# EAGLE design usb-bridge (EAGLE 9.6.2)

## Sheet 1 of 2
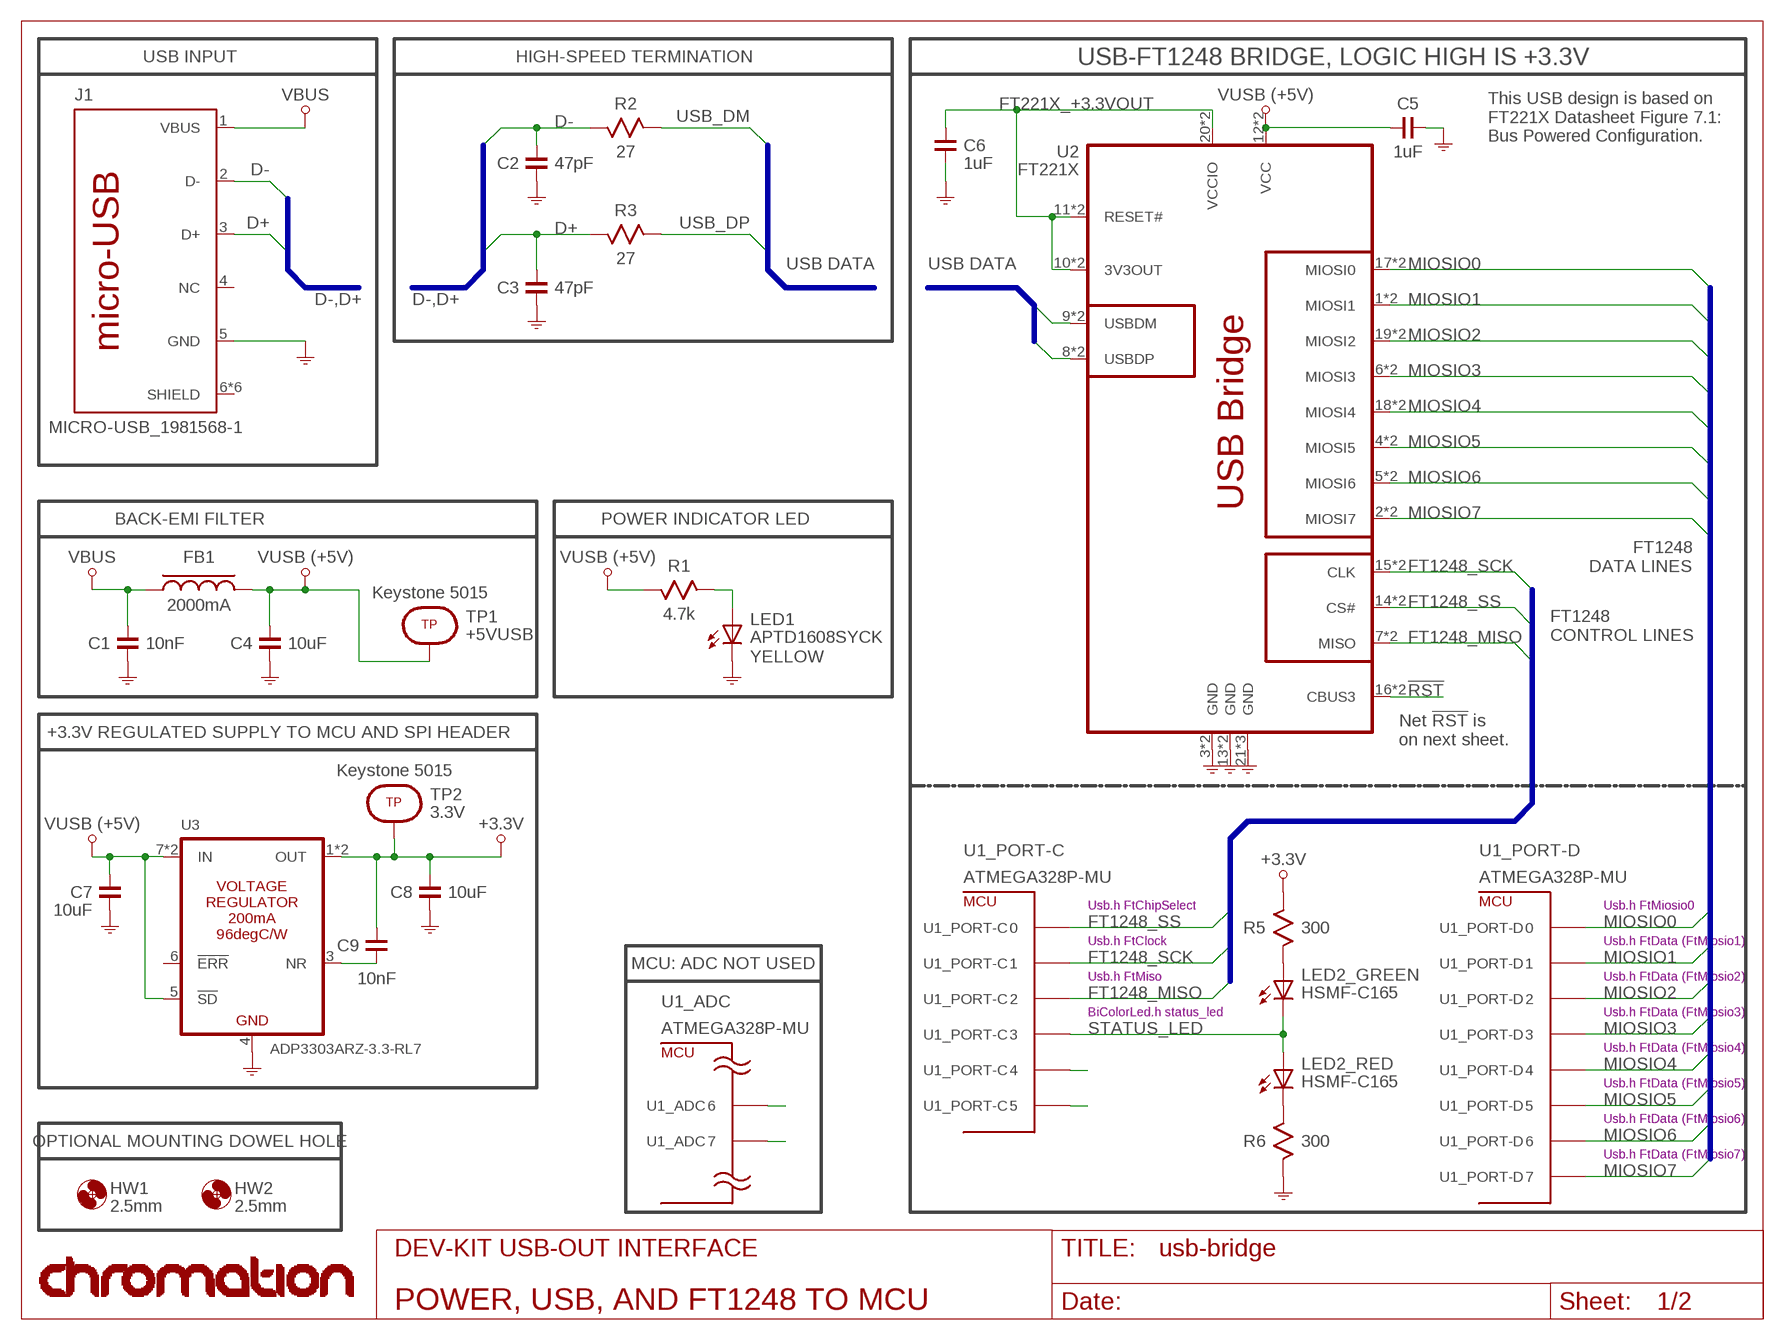
[diagram p0: schematic, sheet 1]

### Parts
C1  10nF  C_0603  [0603]
C2  47pF  C_0603  [0603]
C3  47pF  C_0603  [0603]
C4  10uF  C_0603  [0603]
C5  1uF  C_0603  [0603]
C6  1uF  C_0603  [0603]
C7  10uF  C_0603  [0603]
C8  10uF  C_0603  [0603]
C9  10nF  C_0603  [0603]
FB1  2000mA  FB_0603-LAIRD  [FB-LAIRD-0603]
HW1  2.5mm  DOWEL-PIN_2.5MM-DOWEL  [MCMASTER-93600A265]
HW2  2.5mm  DOWEL-PIN_2.5MM-DOWEL  [MCMASTER-93600A265]
J1  MICRO-USB_1981568-1  [TE_1981568-1]
LED1  APTD1608SYCK  APTD1608SYCK_LED-0603  [LED-0603-KINGBRIGHT]
LED2  HSMF-C165  BICOLOR-LED_HSMF-C16X  [HSMF-C16X]
R1  4.7k  R_0603  [0603]
R2  27  R_0603  [0603]
R3  27  R_0603  [0603]
R5  300  R_0603  [0603]
R6  300  R_0603  [0603]
TP1  Keystone 5015  TEST-POINT_SMT-5015  [SMT-TEST-POINT-5015]
TP2  Keystone 5015  TEST-POINT_SMT-5015  [SMT-TEST-POINT-5015]
U1  ATMEGA328P-MU  [QFN-32_ATMEL]
U2  FT221X  FT221XQ  [QFN-20]
U3  ADP3303ARZ-3.3-RL7  ADP3303_ARZ-3.3  [SOIC-8_AD]

### Nets
!RST!: U2.16(CBUS3) U2._16(CBUS3) ; also sheet 2
+3.3V: C8.1 C9.1 R5.1 TP2.1 U3.1(OUT) U3.2(OUT) ; also sheet 2
+5VUSB: C4.1 C5.1 C7.1 FB1.2 R1.1 TP1.1 U2.12(VCC) U2._12(VCC) U3.5(!SD!) U3.7(IN) U3.8(IN)
D+: C3.1 J1.3(D+) R3.1
D-: C2.1 J1.2(D-) R2.1
FT221X_+3.3VOUT: C6.1 U2.10(3V3OUT) U2.11(RESET#) U2.20(VCCIO) U2._10(3V3OUT) U2._11(RESET#) U2._20(VCCIO)
FT1248_MISO: U1.25 U1.25F U2.7(MISO) U2._7(MISO)
FT1248_SCK: U1.24 U1.24F U2.15(CLK) U2._15(CLK)
FT1248_SS: U1.23 U1.23F U2.14(CS#) U2._14(CS#)
GND: C1.2 C2.2 C3.2 C4.2 C5.2 C6.2 C7.2 C8.2 J1.5(GND) LED1.2(C) R6.2 U2.3(GND) U2.13(GND) U2.21(GND) U2.21A(GND) U2.21B(GND) U2._3(GND) U2._13(GND) U3.4(GND) ; also sheet 2
MIOSIO0: U1.30 U1.30F U2.17(MIOSI0) U2._17(MIOSI0)
MIOSIO1: U1.31 U1.31F U2.1(MIOSI1) U2._1(MIOSI1)
MIOSIO2: U1.32 U1.32F U2.19(MIOSI2) U2._19(MIOSI2)
MIOSIO3: U1.1 U1.1F U2.6(MIOSI3) U2._6(MIOSI3)
MIOSIO4: U1.2 U1.2F U2.18(MIOSI4) U2._18(MIOSI4)
MIOSIO5: U1.9 U1.9F U2.4(MIOSI5) U2._4(MIOSI5)
MIOSIO6: U1.10 U1.10F U2.5(MIOSI6) U2._5(MIOSI6)
MIOSIO7: U1.11 U1.11F U2.2(MIOSI7) U2._2(MIOSI7)
N$1: LED2.4(_RED:C) R6.1
N$2: LED2.1(_GREEN:A) R5.2
N$10: LED1.1(A) R1.2
NOISE_REDUCTION: C9.2 U3.3(NR)
NOT-USED-19: U1.19 U1.19F
NOT-USED-22: U1.22 U1.22F
NOT-USED-27: U1.27 U1.27F
NOT-USED-28: U1.28 U1.28F
STATUS_LED: LED2.2(_RED:A) LED2.3(_GREEN:C) U1.26 U1.26F
USB_DM: R2.2 U2.9(USBDM) U2._9(USBDM)
USB_DP: R3.2 U2.8(USBDP) U2._8(USBDP)
VBUS: C1.1 FB1.1 J1.1(VBUS)
Unconnected: J1.4(NC) J1.6(SHIELD) J1.7(SHIELD) J1.8(SHIELD) J1.9(SHIELD) J1.10(SHIELD) J1.11(SHIELD) U3.6(!ERR!)

### Buses
D-,D+
USB_DM,USB_DP
MIOSIO[0..7]
FT1248_SS,FT1248_SCK,FT1248_MISO

### Notes on the sheet
- USB INPUT | HIGH-SPEED TERMINATION | USB-FT1248 BRIDGE, LOGIC HIGH IS +3.3V
- This USB design is based on
  FT221X Datasheet Figure 7.1:
  Bus Powered Configuration.
- USB DATA | USB DATA
- BACK-EMI FILTER | POWER INDICATOR LED
- FT1248
  DATA LINES
- FT1248
  CONTROL LINES
- YELLOW
- Net !RST! is
  on next sheet.
- +3.3V REGULATED SUPPLY TO MCU AND SPI HEADER
- Usb.h FtChipSelect | Usb.h FtMiosio0
- Usb.h FtClock | Usb.h FtData (FtMiosio1)
- MCU: ADC NOT USED
- Usb.h FtMiso | Usb.h FtData (FtMiosio2)
- BiColorLed.h status_led | Usb.h FtData (FtMiosio3)
- Usb.h FtData (FtMiosio4)
- Usb.h FtData (FtMiosio5)
- Usb.h FtData (FtMiosio6)
- OPTIONAL MOUNTING DOWEL HOLE
- Usb.h FtData (FtMiosio7)
- DEV-KIT USB-OUT INTERFACE
- POWER, USB, AND FT1248 TO MCU

## Sheet 2 of 2
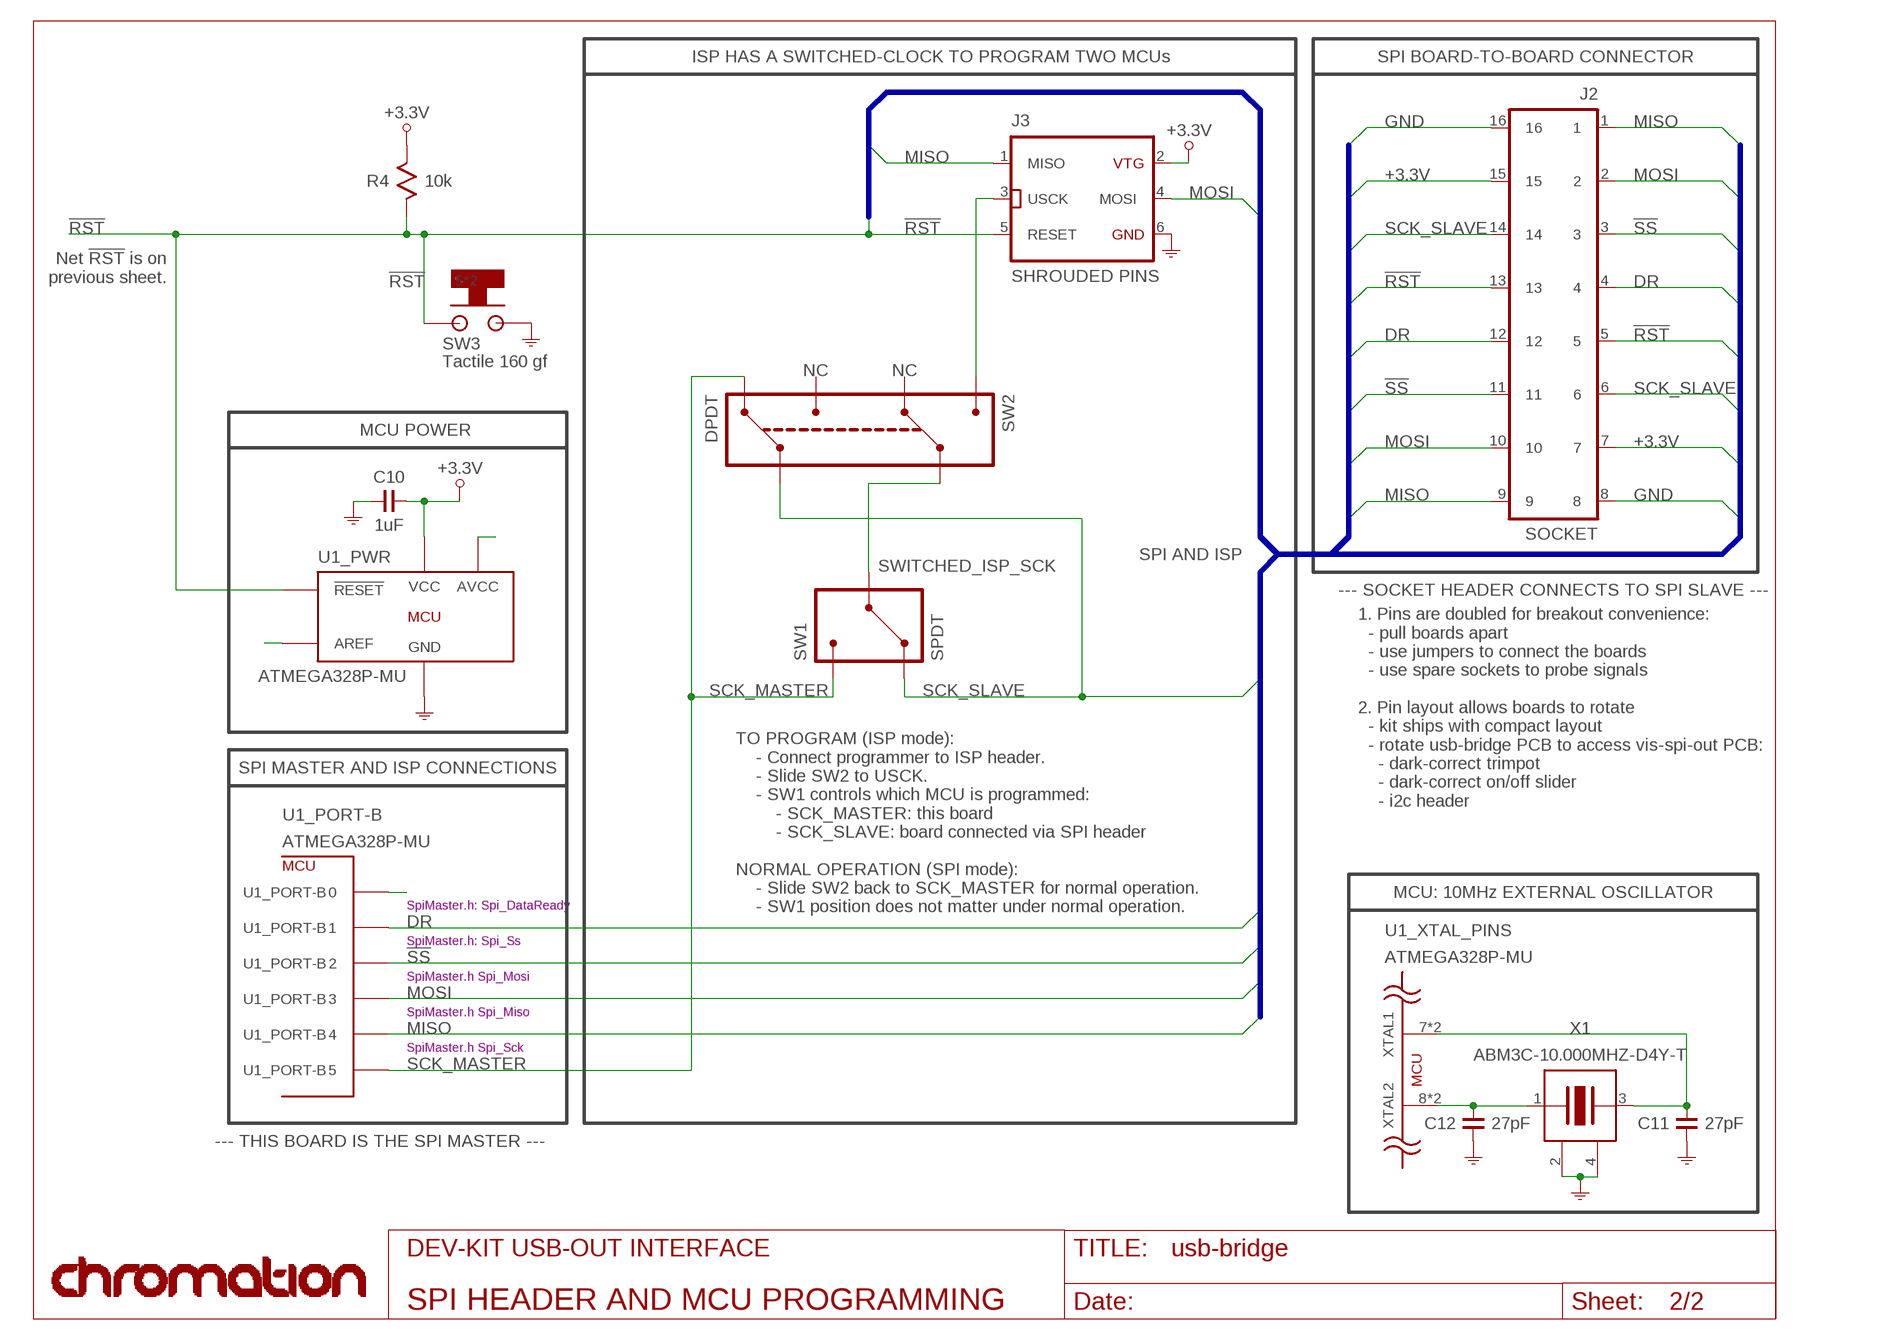
[diagram p1: schematic, sheet 2]

### Parts
C10  1uF  C_0603  [0603]
C11  27pF  C_0603  [0603]
C12  27pF  C_0603  [0603]
J2  SOCKET  HEADER-SOCKET-16_SSM-108-F-DV  [SSM-108-L-DV]
J3  SHROUDED PINS  AVRISP_N2506-6V0C-RB-WD  [N2506-6V0C]
R4  10k  R_0603  [0603]
SW1  SPDT  SW_SPDT_JS102011JCQN  [JS102011JCQN]
SW2  DPDT  SW_DPDT_JS202011JCQN  [JS202011JCQN]
SW3  Tactile 160 gf  PUSH-BUTTON_MSLPT5252BL3MTR  [MSLPT5252BL3MTR]
X1  ABM3C-10.000MHZ-D4Y-T  CRYSTAL_ABM3C-10.000MHZ-D4Y-T  [CRYSTAL]

### Nets
!RST!: J2.5 J2.13 J3.5(RESET) R4.2 SW3.3(3,4) SW3.4(3,4) U1.29(_PWR:!RESET!) U1.29F(_PWR:!RESET!) ; also sheet 1
!SS!: J2.3 J2.11 U1.14 U1.14F
+3.3V: C10.2 J2.7 J2.15 J3.2(VTTL) R4.1 U1.4(_PWR:VCC) U1.4F(_PWR:VCC) U1.6(_PWR:VCC) U1.6F(_PWR:VCC) ; also sheet 1
DR: J2.4 J2.12 U1.13 U1.13F
GND: C10.1 C11.2 C12.2 J2.8 J2.16 J3.6(GND) SW3.1(1,2) SW3.2(1,2) U1.3(_PWR:GND) U1.3F(_PWR:GND) U1.5(_PWR:GND) U1.5F(_PWR:GND) U1.21(_PWR:GND) U1.21F(_PWR:GND) U1.THERMAL(_PWR:GND) X1.2(GND) X1.4(GND) ; also sheet 1
ISP_SCK: J3.3(USCK) SW2.1
MISO: J2.1 J2.9 J3.1(MISO) U1.16 U1.16F
MOSI: J2.2 J2.10 J3.4(MOSI) U1.15 U1.15F
N$3: C11.1 U1.7(_XTAL_PINS:XTAL1) U1.7F(_XTAL_PINS:XTAL1) X1.3
N$4: C12.1 U1.8(_XTAL_PINS:XTAL2) U1.8F(_XTAL_PINS:XTAL2) X1.1
NOT-USED-12: U1.12 U1.12F
NOT-USED-18: U1.18(_PWR:AVCC) U1.18F(_PWR:AVCC)
NOT-USED-20: U1.20(_PWR:AREF) U1.20F(_PWR:AREF)
SCK_MASTER: SW1.1 SW2.6 U1.17 U1.17F
SCK_SLAVE: J2.6 J2.14 SW1.3 SW2.5
SWITCHED_ISP_SCK: SW1.2 SW2.2
Unconnected: SW2.3 SW2.4 SW3.5(5,6) SW3.6(5,6)

### Buses
SCK_SLAVE,MISO,MOSI,!SS!,DR,!RST!,+3.3V,GND

### Notes on the sheet
- ISP HAS A SWITCHED-CLOCK TO PROGRAM TWO MCUs | SPI BOARD-TO-BOARD CONNECTOR
- Net !RST! is on
  previous sheet.
- NC | NC
- MCU POWER
- SPI AND ISP
- --- SOCKET HEADER CONNECTS TO SPI SLAVE ---
- 1. Pins are doubled for breakout convenience:
    - pull boards apart
    - use jumpers to connect the boards
    - use spare sockets to probe signals
  
  2. Pin layout allows boards to rotate
    - kit ships with compact layout
    - rotate usb-bridge PCB to access vis-spi-out PCB:
      - dark-correct trimpot
      - dark-correct on/off slider
      - i2c header
- TO PROGRAM (ISP mode):
      - Connect programmer to ISP header.
      - Slide SW2 to USCK.
      - SW1 controls which MCU is programmed:
          - SCK_MASTER: this board
          - SCK_SLAVE: board connected via SPI header
  
  NORMAL OPERATION (SPI mode):
      - Slide SW2 back to SCK_MASTER for normal operation.
      - SW1 position does not matter under normal operation.
- SPI MASTER AND ISP CONNECTIONS
- MCU: 10MHz EXTERNAL OSCILLATOR
- SpiMaster.h: Spi_DataReady
- SpiMaster.h: Spi_Ss
- SpiMaster.h Spi_Mosi
- SpiMaster.h Spi_Miso
- SpiMaster.h Spi_Sck
- --- THIS BOARD IS THE SPI MASTER ---
- DEV-KIT USB-OUT INTERFACE
- SPI HEADER AND MCU PROGRAMMING

## Library data of the parts
C1 C9 = 0603:C_; EXPORT: YES; MANUF: Murata; MANUF_PNUM: GRM1885C1H103JA01D; NOTES: MLCC - SMD/SMT 0603 50VDC 10000pF 5% C0G; VENDOR1: Mouser; VENDOR1_NOTES: --; VENDOR1_PNUM: 81-GRM1885C1H103JA1D; VENDOR1_PQ_00001: 0.21; VENDOR1_PQ_00010: 0.075; VENDOR1_PQ_00025: --; VENDOR1_PQ_00050: 0.014; VENDOR1_PQ_00100: 0.008; VENDOR1_PQ_00500: 0.005; VENDOR1_PQ_01000: 0.003; VENDOR1_PQ_02000: --; VENDOR1_PQ_05000: --; VENDOR1_PQ_10000: --; VENDOR1_STOCK: 45091; VENDOR2: Digikey; VENDOR2_NOTES: --; VENDOR2_PQ_00001: --; VENDOR2_PQ_00010: --; VENDOR2_PQ_00025: --; VENDOR2_PQ_00050: --; VENDOR2_PQ_00100: --; VENDOR2_PQ_00500: --; VENDOR2_PQ_01000: --; VENDOR2_PQ_02000: --; VENDOR2_PQ_05000: --; VENDOR2_PQ_10000: --; VENDOR2_STOCK: --; VENDOR3: Newark; VENDOR3_NOTES: --; VENDOR3_PQ_00001: --; VENDOR3_PQ_00010: --; VENDOR3_PQ_00025: --; VENDOR3_PQ_00050: --; VENDOR3_PQ_00100: --; VENDOR3_PQ_00500: --; VENDOR3_PQ_01000: --; VENDOR3_PQ_02000: --; VENDOR3_PQ_05000: --; VENDOR3_PQ_10000: --; VENDOR3_STOCK: --; WHICH_VENDOR: 1
C2 C3 = 0603:C_; EXPORT: YES; MANUF: Murata; MANUF_PNUM: GCM1885C2A470FA16D; NOTES: MLCC - SMD/SMT 0603 47pF 100volts C0G 1%; VENDOR1: Mouser; VENDOR1_NOTES: --; VENDOR1_PNUM: 81-GCM1885C2A470FA6D; VENDOR1_PQ_00001: 0.24; VENDOR1_PQ_00010: 0.03; VENDOR1_PQ_00025: --; VENDOR1_PQ_00050: 0.016; VENDOR1_PQ_00100: 0.009; VENDOR1_PQ_00500: 0.006; VENDOR1_PQ_01000: 0.004; VENDOR1_PQ_02000: --; VENDOR1_PQ_05000: --; VENDOR1_PQ_10000: --; VENDOR1_STOCK: 34003; VENDOR2: Digikey; VENDOR2_NOTES: --; VENDOR2_PQ_00001: --; VENDOR2_PQ_00010: --; VENDOR2_PQ_00025: --; VENDOR2_PQ_00050: --; VENDOR2_PQ_00100: --; VENDOR2_PQ_00500: --; VENDOR2_PQ_01000: --; VENDOR2_PQ_02000: --; VENDOR2_PQ_05000: --; VENDOR2_PQ_10000: --; VENDOR2_STOCK: --; VENDOR3: Newark; VENDOR3_NOTES: --; VENDOR3_PQ_00001: --; VENDOR3_PQ_00010: --; VENDOR3_PQ_00025: --; VENDOR3_PQ_00050: --; VENDOR3_PQ_00100: --; VENDOR3_PQ_00500: --; VENDOR3_PQ_01000: --; VENDOR3_PQ_02000: --; VENDOR3_PQ_05000: --; VENDOR3_PQ_10000: --; VENDOR3_STOCK: --; WHICH_VENDOR: 1
C4 C7 C8 = 0603:C_; EXPORT: YES; MANUF: Murata Electronics; MANUF_PNUM: GRM188R6YA106MA73D; NOTES: X5R 35V; VENDOR1: Mouser; VENDOR1_PNUM: 81-GRM188R6YA106MA3D; VENDOR1_PQ_00001: 0.49
C5 C6 = 0603:C_; EXPORT: YES; MANUF: Yageo; MANUF_PNUM: CC0603KRX5R8BB105; NOTES: X5R 25V; VENDOR1: Mouser; VENDOR1_PNUM: 603-CC603KRX5R8BB105; VENDOR1_PQ_00001: 0.20
C10 = 0603:C_; EXPORT: YES; MANUF: Yageo; MANUF_PNUM: CC0603KRX5R8BB105; NOTES: 25V X5R 10%; VENDOR1: Mouser; VENDOR1_PNUM: 603-CC603KRX5R8BB105; VENDOR1_PQ_00001: 0.20
C11 C12 = 0603:C_; EXPORT: YES; MANUF: Murata Electronics; MANUF_PNUM: GRM1885C1H270FA01J; NOTES: C0G 1%; VENDOR1: Mouser; VENDOR1_PNUM: 81-GRM185C1H270FA01J; VENDOR1_PQ_00001: 0.18
FB1 = Chromation:FB_; EXPORT: YES; MANUF: Laird Technologies; MANUF_PNUM: MI0603L301R-10; NOTES: 0603 ferrite bead, rated for 2A, 300Ohms at 1MHz, 0.1Ohms at DC, 0.8mm tall; VENDOR1: DigiKey; VENDOR1_PNUM: 240-2374-1-ND; VENDOR1_PQ_00001: 0.19
HW1 HW2 = DOWEL-PIN:DOWEL-PIN_; EXPORT: YES; NOTES: Dowel Pin, 2.5mm Diameter, 12mm Long; VENDOR1: McMaster-Carr; VENDOR1_PNUM: 93600A265; VENDOR1_PQ_00001: 0.27
J1 = MICRO-USB:MICRO-USB_: CONN RCPT MICRO USB B R/A SMD; APPLICATION: POWER & SIGNAL; CONNECTOR: USB-MICRO B; CURRENT_RATING: 1.8; DESIGNATOR: 1981568-1; EXPORT: YES; FINISH: GOLD; FOOTPRINT: SMT; GENDER: Receptacle; LATEST_REVISION_DATE: 13AUG15; LATEST_REVISION_NOTE: REVISED PER ECO-15-009877; MANUF: TE Connectivity / AMP; MANUFACTURER: TE CONNECTIVITY; MANUFACTURER_LINK: http://www.te.com/commerce/DocumentDelivery/DDEController?Action=showdoc&DocId=Customer+Drawing%7F1981568%7FE2%7Fpdf%7FEnglish%7FENG_CD_1981568_E2.pdf%7F1981568-1; MANUF_PNUM: 1981568-1; NOTES: No through-hole retention pegs.; NO_OF_POSITION: 5; ORIENTATION: Right Angle; PACKAGE: USB 2.0; PART_DESCRIPTION: MICRO USB 2.0 PECEPTACLE CONNECTOR R/A TYPE B ASSEMBLY; PART_REV: E2; PITCH: 0.65mm; PUBISHER: TE CONNECTIVITY; PUBLISHED: 07AUG2007; ROHS_COMPLIANT: YES; SERIES: MICRO USB 2.0; STANDARD: MANUFACTURER RECOMMENDATIONS; TECHNOLOGY: Cable-to-Board; TE_PART_NUMBER: 1981568-1; TYPE: USB 2.0 RECEPTACLE; VENDOR1: Mouser; VENDOR1_PNUM: 571-1981568-1; VENDOR1_PQ_00001: 1.50
J2 = HEADER-SOCKET:HEADER-SOCKET-16; EXPORT: YES; MANUF: Samtec; MANUF_PNUM: SSM-108-L-DV-K-TR; NOTES: 16-pin 2x8 header socket; VENDOR1: Mouser; VENDOR1_PNUM: 200-SSM108LDVKTR; VENDOR1_PQ_00001: 3.59
J3 = ISP:AVRISP_; EXPORT: YES; MANUF: 3M; MANUF_PNUM: N2506-6V0C-RB-WD; NOTES: ISP; VENDOR1: Mouser; VENDOR1_PNUM: 517-N2506-6V0C-RB-WD; VENDOR1_PQ_00001: 3.42
LED1 = Chromation:APTD1608SYCK_; EXPORT: YES; MANUF: Kingbright; MANUF_PNUM: APTD1608SYCK; NOTES: Yellow 0603 LED, Vf=1.9V at If=5mA.; VENDOR1: Mouser; VENDOR1_PNUM: 604-APTD1608SYCK; VENDOR1_PQ_00001: 0.26
LED2 = BICOLOR-LED:BICOLOR-LED_; EXPORT: YES; MANUF: Avago; MANUF_PNUM: HSMF-C165; NOTES: Red/Green LED for test/debug.; VENDOR1: Mouser; VENDOR1_PNUM: 630-HSMF-C165; VENDOR1_PQ_00001: 0.39
R1 = YAGEO-0603:R_; EXPORT: YES; MANUF: Yageo; MANUF_PNUM: RC0603FR-074K7L; NOTES: 1% resistance tolerance. 5% substitution is allowed. Was 1k on first qty6 order.; VENDOR1: Mouser; VENDOR1_PNUM: 603-RC0603FR-074K7L; VENDOR1_PQ_00001: 0.10
R2 R3 = YAGEO-0603:R_; EXPORT: YES; MANUF: Yageo; MANUF_PNUM: RC0603FR-0727RL; NOTES: Thick Film Resistors - SMD 1/10watt 27ohms 1%; VENDOR1: Mouser; VENDOR1_NOTES: --; VENDOR1_PNUM: 603-RC0603FR-0727RL; VENDOR1_PQ_00001: 0.10; VENDOR1_PQ_00010: --; VENDOR1_PQ_00025: --; VENDOR1_PQ_00050: --; VENDOR1_PQ_00100: 0.026; VENDOR1_PQ_00500: --; VENDOR1_PQ_01000: --; VENDOR1_PQ_02000: --; VENDOR1_PQ_05000: --; VENDOR1_PQ_10000: --; VENDOR1_STOCK: 20268; VENDOR2: Digikey; VENDOR2_NOTES: --; VENDOR2_PQ_00001: --; VENDOR2_PQ_00010: --; VENDOR2_PQ_00025: --; VENDOR2_PQ_00050: --; VENDOR2_PQ_00100: --; VENDOR2_PQ_00500: --; VENDOR2_PQ_01000: --; VENDOR2_PQ_02000: --; VENDOR2_PQ_05000: --; VENDOR2_PQ_10000: --; VENDOR2_STOCK: --; VENDOR3: Newark; VENDOR3_NOTES: --; VENDOR3_PQ_00001: --; VENDOR3_PQ_00010: --; VENDOR3_PQ_00025: --; VENDOR3_PQ_00050: --; VENDOR3_PQ_00100: --; VENDOR3_PQ_00500: --; VENDOR3_PQ_01000: --; VENDOR3_PQ_02000: --; VENDOR3_PQ_05000: --; VENDOR3_PQ_10000: --; VENDOR3_STOCK: --; WHICH_VENDOR: 1
R4 = YAGEO-0603:R_; EXPORT: YES; MANUF: Yageo; MANUF_PNUM: RC0603FR-0710KL; NOTES: 1% resistance tolerance. 5% substitution is allowed.; VENDOR1: Mouser; VENDOR1_PNUM: 603-RC0603FR-0710KL; VENDOR1_PQ_00001: 0.10
R5 R6 = YAGEO-0603:R_; EXPORT: YES; MANUF: Yageo; MANUF_PNUM: RC0603FR-07300RL; NOTES: Current-limiting resistor, 1% tolerance. 5% tolerance is allowed.; VENDOR1: Mouser; VENDOR1_PNUM: 603-RC0603FR-07300RL; VENDOR1_PQ_00001: 0.10
SW1 = SPDT:SW_SPDT_; EXPORT: YES; MANUF: C&K; MANUF_PNUM: JS102011JCQN; NOTES: SPDT SMT slide switch; VENDOR1: Mouser; VENDOR1_PNUM: 611-JS102011JCQN; VENDOR1_PQ_00001: 0.71
SW2 = DPDT:SW_DPDT_; EXPORT: YES; MANUF: C&K; MANUF_PNUM: JS202011JCQN; NOTES: DPDT SMT slide switch; VENDOR1: Mouser; VENDOR1_PNUM: 611-JS202011JCQN; VENDOR1_PQ_00001: 0.46
SW3 = PUSH-BUTTON:PUSH-BUTTON_; EXPORT: YES; MANUF: TE Connectivity / Alcoswitch; MANUF_PNUM: MSLPT5252BG3MTR; NOTES: Resets both microcontrollers.; VENDOR1: Mouser; VENDOR1_PNUM: 506-MSLPT5252BL3MTR; VENDOR1_PQ_00001: 0.58
TP1 = TEST-POINT:TEST-POINT_; EXPORT: YES; MANUF: Keystone Electronics; MANUF_PNUM: 5015; NOTES: surface mount test point; TP_SIGNAL_NAME: +5VUSB; VENDOR1: Mouser; VENDOR1_PNUM: 534-5015; VENDOR1_PQ_00001: 0.35
TP2 = TEST-POINT:TEST-POINT_; EXPORT: YES; MANUF: Keystone Electronics; MANUF_PNUM: 5015; NOTES: surface mount test point; TP_SIGNAL_NAME: 3.3V; VENDOR1: Mouser; VENDOR1_PNUM: 534-5015; VENDOR1_PQ_00001: 0.35
U1 = ATMEGA328:ATMEGA328P-; EXPORT: YES; MANUF: Atmel; MANUF_PNUM: ATMEGA328P-MUR; NOTES: 8-bit MCU: 10MHz at 3.3V, one i2c, one USART (in SPI mode), software-defined FT1248.; VENDOR1: Mouser; VENDOR1_PNUM: 556-ATMEGA328P-MUR; VENDOR1_PQ_00001: 3.57
U2 = FT221X:FT221X; EXPORT: YES; MANUF: FTDI; MANUF_PNUM: FT221XQ-R; NOTES: USB Bridge IC; VENDOR1: Mouser; VENDOR1_PNUM: 895-FT221XQ-R; VENDOR1_PQ_00001: 2.12
U3 = Chromation:ADP3303_; EXPORT: YES; MANUF: Analog Devices; MANUF_PNUM: ADP3303ARZ-3.3-RL7; NOTES: 200mA LDO, 96degC/W.; VENDOR1: Mouser; VENDOR1_PNUM: 584-ADP3303ARZ3.3R7; VENDOR1_PQ_00001: 3.33
X1 = CRYSTAL:CRYSTAL_; EXPORT: YES; MANUF: ABRACON; MANUF_PNUM: ABM3C-10.000MHZ-D4Y-T; NOTES: 10MHz crystal oscillator SMT 4-pads; VENDOR1: Mouser; VENDOR1_PNUM: 815-ABM3C-10-D4YT; VENDOR1_PQ_00001: 0.69

## Board
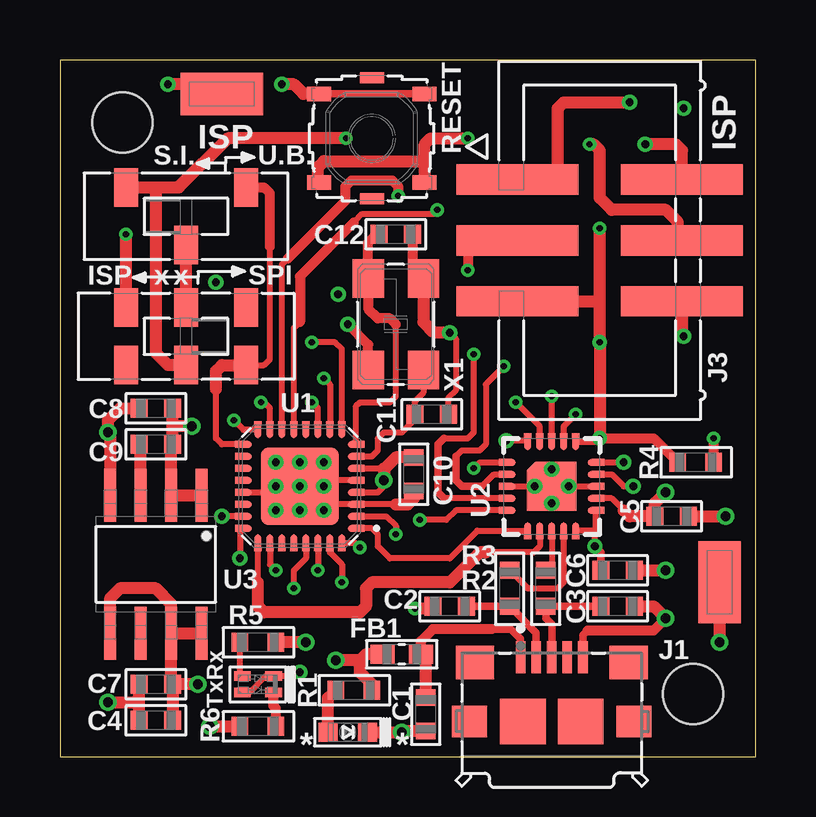
[diagram p2: board, top side]
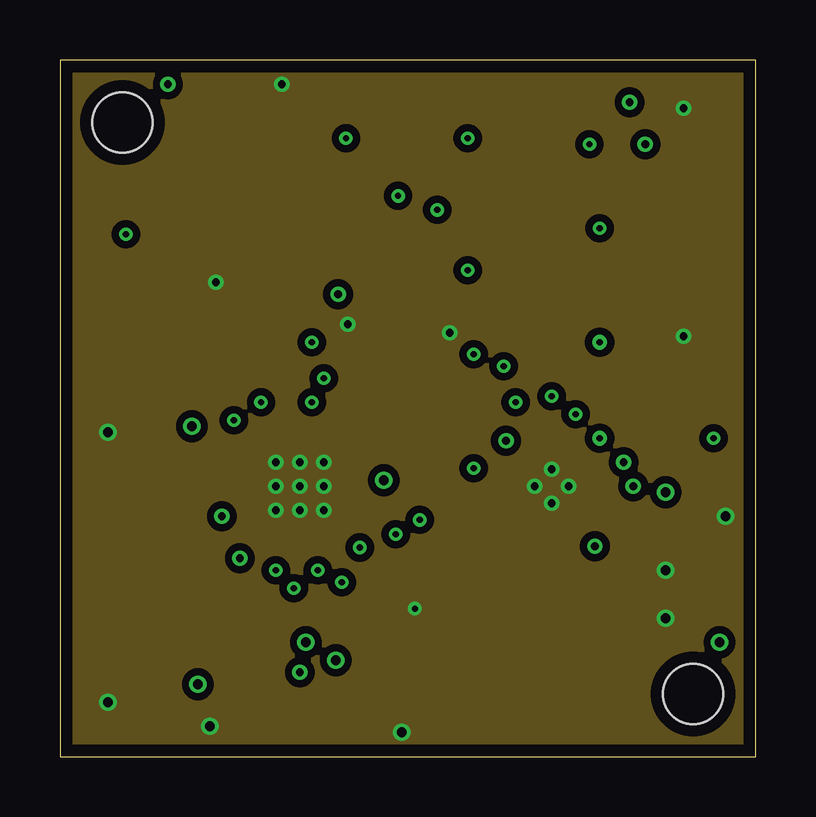
[diagram p3: board, inner layer Route2]
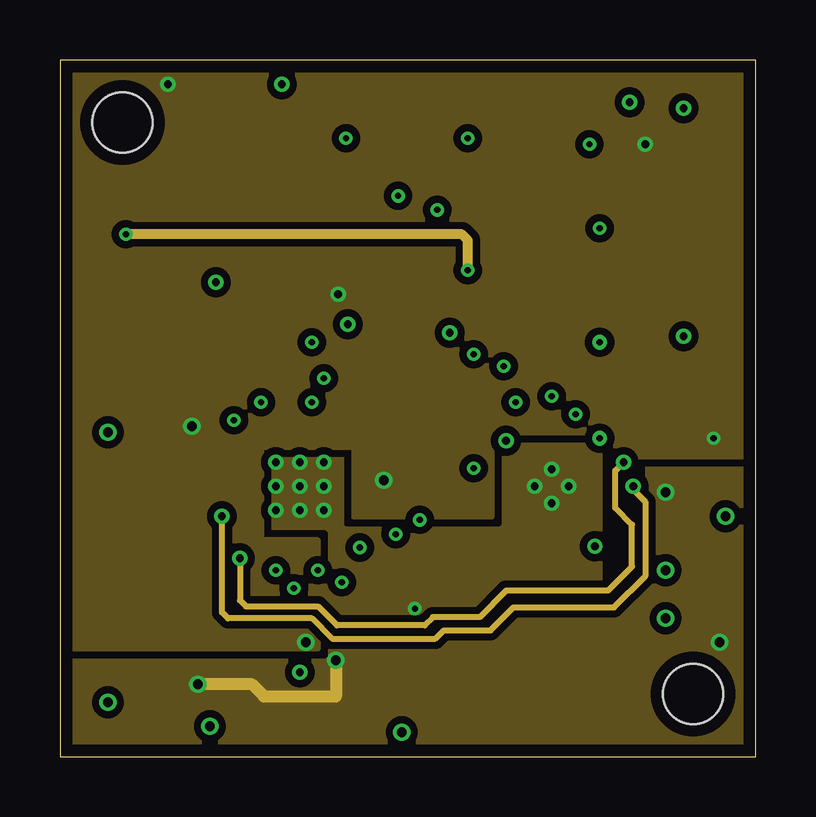
[diagram p4: board, inner layer Route15]
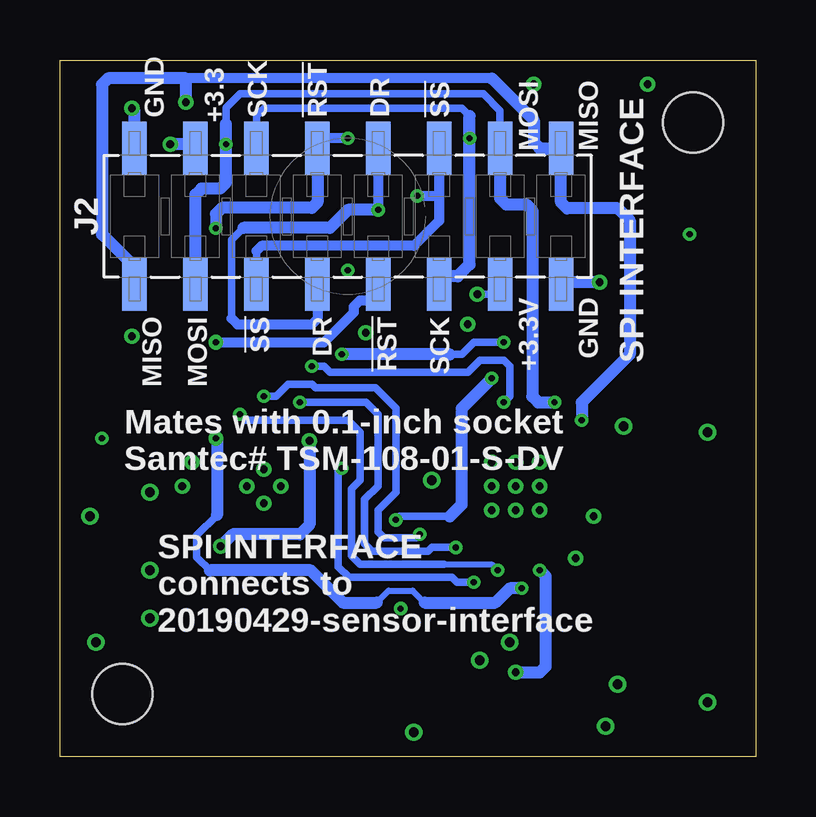
[diagram p5: board, bottom side, seen from below]

Size 29 x 29.02 mm. Coordinates in mm from the lower left corner, seen from the top.
Outline: 0,0 29,0 29,29.02 0,29.02 0,0
Copper layers (1*2*15*16): Top 0.035mm / dielectric 0.23mm / Route2 0.035mm / dielectric 0.93mm / Route15 0.035mm / dielectric 0.23mm / Bottom 0.035mm
Design rules "MF_Standard_4_Layer-modified-for-PCB-NG": minimum track width 4mil, minimum drill 8mil, track to track 4mil, track to pad 4mil, pad to pad 4mil, via to via 4mil, smd to smd 0mil, copper to edge 20mil, drill to drill 8mil, minimum pad ring 8mil, minimum via ring 6mil, stop-mask expansion 4mil, vias tented up to drill 100mil, thermal gap 10mil

### Footprints (pad centres in the part's own frame; a part is rotated, then mirrored left to right if it is on the bottom)
0603 = smd 0.7 x 0.8: 1 -0.7,0; 2 0.7,0
FB-LAIRD-0603 = smd 1 x 0.8: 1 -0.8,0; 2 0.8,0
MCMASTER-93600A265 = hole 2.5: 0,0
TE_1981568-1 = smd 0.4 x 1.35: 1 -1.3,2.675; 2 -0.65,2.675; 3 0,2.675; 4 0.65,2.675; 5 1.3,2.675 | smd 1.6 x 1.4: 6 -3.2,2.45; 7 3.2,2.45 | smd 1.45 x 1.3: 8 3.425,0; 9 -3.425,0 | smd 1.9 x 1.9: 10 -1.2,0; 11 1.2,0
SSM-108-L-DV = smd 1.02 x 2.22: 1 -8.89,-2.825; 2 -6.35,-2.825; 3 -3.81,-2.825; 4 -1.27,-2.825; 5 1.27,-2.825; 6 3.81,-2.825; 7 6.35,-2.825; 8 8.89,-2.825; 9 8.89,2.825; 10 6.35,2.825; 11 3.81,2.825; 12 1.27,2.825; 13 -1.27,2.825; 14 -3.81,2.825; 15 -6.35,2.825; 16 -8.89,2.825
N2506-6V0C = smd 1.27 x 5.08: 1 -2.54,-3.43; 2 -2.54,3.43; 3 0,-3.43; 4 0,3.43; 5 2.54,-3.43; 6 2.54,3.43
LED-0603-KINGBRIGHT = smd 0.8 x 0.8: 1 -0.825,0; 2 0.825,0
HSMF-C16X = smd 0.7 x 0.4: 1 -0.65,0.35; 2 -0.65,-0.35; 3 0.65,0.35; 4 0.65,-0.35
0603' = smd 0.7 x 0.8: 1 -0.75,0; 2 0.75,0
JS102011JCQN = smd 1 x 1.6: 1 -2.5,-1.2; 2 0,1.2; 3 2.5,-1.2
JS202011JCQN = smd 1 x 1.6: 1 -2.5,1.2; 2 0,1.2; 3 2.5,1.2; 4 -2.5,-1.2; 5 0,-1.2; 6 2.5,-1.2
MSLPT5252BL3MTR = smd 0.6 x 1: 1 1.85,2.2; 2 1.85,-2.2; 3 -1.85,2.2; 4 -1.85,-2.2 | smd 0.45 x 1: 5 2.525,0; 6 -2.525,0
SMT-TEST-POINT-5015 = smd 3.43 x 1.78: 1 0,0
QFN-32_ATMEL = smd 0.7 x 0.3: 1 -2.35,1.75; 2 -2.35,1.25; 3 -2.35,0.75; 4 -2.35,0.25; 5 -2.35,-0.25; 6 -2.35,-0.75; 7 -2.35,-1.25; 8 -2.35,-1.75; 17 2.35,-1.75; 18 2.35,-1.25; 19 2.35,-0.75; 20 2.35,-0.25; 21 2.35,0.25; 22 2.35,0.75; 23 2.35,1.25; 24 2.35,1.75 | smd 0.15 x 0.3: 1F -2.625,1.75; 2F -2.625,1.25; 3F -2.625,0.75; 4F -2.625,0.25; 5F -2.625,-0.25; 6F -2.625,-0.75; 7F -2.625,-1.25; 8F -2.625,-1.75; 17F 2.625,-1.75; 18F 2.625,-1.25; 19F 2.625,-0.75; 20F 2.625,-0.25; 21F 2.625,0.25; 22F 2.625,0.75; 23F 2.625,1.25; 24F 2.625,1.75 | smd 0.3 x 0.7: 9 -1.75,-2.35; 10 -1.25,-2.35; 11 -0.75,-2.35; 12 -0.25,-2.35; 13 0.25,-2.35; 14 0.75,-2.35; 15 1.25,-2.35; 16 1.75,-2.35; 25 1.75,2.35; 26 1.25,2.35; 27 0.75,2.35; 28 0.25,2.35; 29 -0.25,2.35; 30 -0.75,2.35; 31 -1.25,2.35; 32 -1.75,2.35 | smd 0.3 x 0.15: 9F -1.75,-2.625; 10F -1.25,-2.625; 11F -0.75,-2.625; 12F -0.25,-2.625; 13F 0.25,-2.625; 14F 0.75,-2.625; 15F 1.25,-2.625; 16F 1.75,-2.625; 25F 1.75,2.625; 26F 1.25,2.625; 27F 0.75,2.625; 28F 0.25,2.625; 29F -0.25,2.625; 30F -0.75,2.625; 31F -1.25,2.625; 32F -1.75,2.625 | smd 3.25 x 3.25: THERMAL 0,0
QFN-20 = smd 0.7 x 0.3: 1 -1.85,1; 2 -1.85,0.5; 3 -1.85,0; 4 -1.85,-0.5; 5 -1.85,-1; 11 1.85,-1; 12 1.85,-0.5; 13 1.85,0; 14 1.85,0.5; 15 1.85,1 | smd 0.3 x 0.7: 6 -1,-1.85; 7 -0.5,-1.85; 8 0,-1.85; 9 0.5,-1.85; 10 1,-1.85; 16 1,1.85; 17 0.5,1.85; 18 0,1.85; 19 -0.5,1.85; 20 -1,1.85 | smd 2.05 x 1.7: 21 0,-0.175 | smd 0.495 x 0.495 rotated 45: 21A -0.675,0.675 | smd 1.7 x 0.35: 21B 0.175,0.85 | smd 0.2 x 0.3: _1 -2.1,1; _2 -2.1,0.5; _3 -2.1,0; _4 -2.1,-0.5; _5 -2.1,-1; _11 2.1,-1; _12 2.1,-0.5; _13 2.1,0; _14 2.1,0.5; _15 2.1,1 | smd 0.3 x 0.2: _6 -1,-2.1; _7 -0.5,-2.1; _8 0,-2.1; _9 0.5,-2.1; _10 1,-2.1; _16 1,2.1; _17 0.5,2.1; _18 0,2.1; _19 -0.5,2.1; _20 -1,2.1
SOIC-8_AD = smd 0.5 x 2.2: 1 -1.905,-2.875; 2 -0.635,-2.875; 3 0.635,-2.875; 4 1.905,-2.875; 5 1.905,2.875; 6 0.635,2.875; 7 -0.635,2.875; 8 -1.905,2.875
CRYSTAL = smd 1.6 x 1.3: 1 -1.9,-1.15; 2 1.9,-1.15; 3 1.9,1.15; 4 -1.9,1.15

### Placement (x,y rotation side)
C1  15.25,1.76 270 top
C2  16.25,6.26 180 top
C3  23.25,6.26 0 top
C4  4,1.51 180 top
C5  25.5,10.01 0 top
C6  23.25,7.76 0 top
C7  4,3.01 180 top
C8  4,14.51 180 top
C9  4,13.01 180 top
C10  14.75,11.76 90 top
C11  15.5,14.26 0 top
C12  14,21.76 0 top
FB1  14.25,4.26 180 top
HW1  2.6,26.41 0 top
HW2  26.4,2.61 0 top
J1  20.5,1.46 0 top
J2  17,22.51 0 bottom
J3  22.5,21.51 270 top
LED1  12,1.01 0 top
LED2  8.25,3.01 0 top
R1  4.7k  [0603']  12.25,2.76 180 top
R2  27  [0603']  18.75,7.01 90 top
R3  27  [0603']  20.25,7.01 90 top
R4  10k  [0603']  26.5,12.26 180 top
R5  300  [0603']  8.25,4.76 180 top
R6  300  [0603']  8.25,1.26 180 top
SW1  5.25,22.51 180 top
SW2  5.25,17.51 0 top
SW3  13,25.76 90 top
TP1  27.5,7.26 90 top
TP2  6.75,27.61 0 top
U1  10,11.26 180 top
U2  20.5,11.26 0 top
U3  4,8.01 180 top
X1  14,18.01 270 top

### Tracks (layer width: path | path; a pad name or v marks a point on that pad's centre or on a via)
!RST!  (via drill 0.25, 0.25 pad 0.61)
  Top 0.127: U2.16 U2._16
  Top 0.254: 22.45,13.21 v22.5,13.26 22.35,13.11 U2.16 | U1.29 U1.29F 10.25,8.26 9.75,7.76 v9.75,7.01
  Top 0.305: SW3.3 10.75,23.96 | SW3.4 15.35,23.91
  Top 0.406: v22.5,13.26 24.75,13.26 R4.2
  Top 0.508: J3.5 22.46,18.97 22.5,19.01 | v22.5,13.26 v22.5,17.26 22.5,19.01 | 10.75,23.96 10.75,24.56 11,24.81 15.2,24.81 | 15.2,24.81 SW3.4 | v17,25.76 15.45,25.76 15.2,25.51 15.2,24.81 | 22.5,19.01 v22.5,22.01
  Bottom 0.254: J2.5 15.75,19.67 | 18.02,25.76 18.27,25.51 J2.13 | 15.8,6.41 15.3,6.91 14.3,6.91 13.8,6.41
  Bottom 0.305: v22.5,17.26 22.5,17.31 22.45,17.26 | 22.45,10.06 23.3,9.21 23.3,8.31 22.75,7.76
  Bottom 0.406: 22.45,17.26 18,17.26 16.75,18.51 16.75,18.76 16.5,19.01 15.75,19.01 15.75,19.67 | v17,25.76 18.02,25.76 | v22.5,13.26 22.45,13.21
  Bottom 0.508: 13.8,6.41 10.85,6.41 10.25,7.01 v9.75,7.01 | J2.13 18.27,23.09 18.5,22.86 22.25,22.86 22.5,22.61 v22.5,22.01 | 22.45,13.21 22.45,10.06 | 15.8,6.41 17.2,6.41 18.55,7.76 22.75,7.76
!SS!  (via drill 0.25)
  Top 0.254: U1.14 U1.14F 9.25,20.51 9.5,20.76
  Top 0.406: v14.1,23.36 14.1,23.76 13.85,24.01 12.15,24.01 11.9,23.76 11.9,23.16 9.5,20.76
  Bottom 0.254: 13.19,23.36 13.19,23.71
  Bottom 0.305: J2.3 20.81,21.07
  Bottom 0.406: J2.11 13.19,23.71 13.19,22.32 14.23,21.28 20.6,21.28 20.81,21.07 | v14.1,23.36 13.19,23.36
+3.3V  (via drill 0.25, 0.33, 0.41)
  Top 0.254: U1.4 U1.4F 13.25,11.01 13.5,11.26 v13.5,11.51 | U1.6 U1.6F 13.5,12.01
  Top 0.406: R4.1 v27.25,13.26
  Top 0.508: 4.7,13.76 C9.1 4.63,12.95 U3.2 U3.1 | 4.7,13.76 C8.1 | v10.25,4.76 R5.1 | v5.5,13.76 4.7,13.76 | C10.2 14,12.46 13.5,11.96 | 13.5,12.01 13.5,11.96 | 13.5,11.96 v13.5,11.51 | J3.2 25.93,25.26 25.68,25.51 v24.4,25.51 | v4.5,28.01 6.75,28.01 TP2.1
  Bottom 0.305: J2.7 11.07,19.26 v11.6,19.26
  Bottom 0.508: J2.15 23.18,25.51 v24.4,25.51
  pour Route15 (isolate 0.305, rank 2): 0,4.51 10.75,4.51 10.75,9.01 8.4,9.01 8.4,12.91 12.25,12.91 12.25,10.01 18,10.01 18,13.51 22.5,13.51 23.5,12.51 29,12.51 29,29.01 0,29.01
+5VUSB  (via drill 0.41, 0.41 pad 0.61)
  Top 0.254: U2.12 U2._12 23,10.76 23.5,10.26
  Top 0.508: C7.1 4.63,3.08 U3.7 | U3.7 U3.8 | U3.7 4.63,6.38 4,7.01 2.5,7.01 2.1,6.61 U3.5 | C7.1 C4.1 | v5.75,3.01 C7.1 | 12.5,4.01 v11.5,4.01 | R1.1 13,3.01 12.5,3.51 12.5,4.01 | FB1.2 12.75,4.26 12.5,4.01 | 23.5,10.26 23.75,10.01 C5.1 24.8,10.56 v25.25,11.01 | v27.5,4.76 TP1.1
  Route15 0.508: v5.75,3.01 8,3.01 8.5,2.51 11.5,2.51 v11.5,4.01
  pour Route15 (isolate 0.305, rank 5): 0,0.01 29,0.01 29,12.51 24.5,12.51 24.5,7.51 17.5,6.01 10.75,6.01 10.75,4.51 0,4.51
D+
  Top 0.305: C3.1 R3.1 20.25,5.76 20.5,5.51 J1.3
D-
  Top 0.305: C2.1 R2.1 19.85,5.16 J1.2
DR  (via drill 0.25)
  Top 0.254: U1.13 U1.13F 9.75,17.86 10,18.11 | 12.25,22.26 12.6,22.61 15.56,22.61 v15.73,22.78
  Top 0.406: 10,18.11 10,20.01 12.25,22.26
  Bottom 0.305: 21.85,18.26 21.85,21.53 21.35,22.03
  Bottom 0.406: 21.85,18.26 21.6,18.01 18.5,18.01 18.27,18.24 J2.4 | J2.12 v15.73,22.78
  Bottom 0.508: v15.73,22.78 17,22.78 17.75,22.03 21.35,22.03
FT221X_+3.3VOUT  (via drill 0.33)
  Top 0.127: 19.45,13.16 19.45,13.31 U2._20 | U2.10 U2._10 | U2.11 U2._11
  Top 0.254: 18.65,13.21 v18.6,13.16 19.45,13.16 U2.20 | v22.3,8.76 22.3,9.31 | 22.3,9.31 22.2,9.41 U2.10 | 22.3,9.31 22.35,9.36 U2.11
  Top 0.305: C6.1 22.55,8.51 v22.3,8.76
  Bottom 0.508: v18.6,13.16 18.6,9.66 19,9.26 21.8,9.26 v22.3,8.76
FT1248_MISO
  Top 0.254: U2.7 U2._7 20,8.76 19.75,8.51 17.75,8.51 | 8.25,7.26 U1.25F U1.25
  Top 0.508: 17.75,8.51 17.5,8.51 16.25,7.26 13,7.26 12.75,7.01 12.75,6.26 12.5,6.01 8.5,6.01 8.25,6.26 8.25,7.26
FT1248_SCK  (via drill 0.33)
  Top 0.127: U1.24F U1.24
  Top 0.254: U2.15 U2._15 v23.5,12.26 | U1.24 7.5,9.36 v7.5,8.26
  Route15 0.254: v7.5,8.26 7.5,6.51 7.75,6.26 10.75,6.26 11.55,5.46 15.2,5.46 15.55,5.81 17.5,5.81 18.6,6.91 22.85,6.91 23.85,7.91 23.85,9.66 23.15,10.36 23.15,11.91 v23.5,12.26
FT1248_SS  (via drill 0.33)
  Top 0.254: U1.23 U1.23F v6.75,10.01 | U2.14 U2._14 23,11.76 23.5,11.26 v23.9,11.26
  Route15 0.254: v23.9,11.26 23.9,11.11 24.4,10.61 24.4,7.51 23.1,6.21 18.9,6.21 17.95,5.26 16,5.26 15.65,4.91 11.35,4.91 10.5,5.76 7,5.76 6.75,6.01 v6.75,10.01
GND  (via drill 0.25, 0.33, 0.41)
  Top 0.127: U1.5 U1.5F | U1.21F U1.21 | U2.21 19.79,11.09 v19.79,11.26 19.79,11.94 U2.21A | v20.5,11.97 20.68,11.97 U2.21B | U2.3 U2._3 | U2.13 U2._13
  Top 0.254: U2.3 v19.79,11.26 | v21.21,11.26 U2.13 | U1.5 11.25,11.51 v11,11.26 | v11,10.26 11.25,10.51 U1.3 U1.3F 14,10.51 | U1.21 8.75,11.01 v9,11.26 | C10.1 14.55,11.06 | C11.2 16.2,14.96 16.5,15.26 16.5,17.41 v16.25,17.66 | C12.2 14.7,21.56
  Top 0.305: J1.5 21.8,5.06 22,5.26 | SW3.2 SW3.1
  Top 0.406: 22,5.26 24.75,5.26 v25.25,5.76 | X1.2 12.85,17.16 v12,18.01 | 14.7,21.56 14.7,20.26 15.05,19.91 X1.4
  Top 0.508: C4.2 3.3,2.26 | 3.3,2.26 C7.2 | v2,2.26 3.3,2.26 | v6.25,1.26 R6.2 | U3.4 2.1,13.42 v2,13.51 2,14.01 2.5,14.51 C8.2 | C1.2 14.3,1.06 v14.25,1.01 LED1.2 | C6.2 v25.25,7.76 | 14,10.51 14.5,10.51 14.75,10.76 C10.1 | X1.4 15.15,18.11 15.6,17.66 v16.25,17.66 | 27.5,18.72 27.25,18.97 J3.6 25.93,17.58 v26,17.51 | SW3.1 10.15,27.61 9.75,28.01 v9.25,28.01 | C3.2 24.75,6.26 v25.25,5.76 | C5.2 v27.75,10.01 | C2.2 15.45,6.16 v14.8,6.16
  Bottom 0.508: v6.5,19.76 8.04,19.76 J2.8 | J2.16 25.89,26.9 v26,27.01
  other vias: 20.5,10.55 10,11.26 10,10.26 10,12.26 9,12.26 9,10.26 11,12.26
  pour Route2 (isolate 0.305, rank 3): 0,0.01 29,0.01 29,29.01 0,29.01
  pour Route15 (isolate 0.305, rank 4): 8.8,12.91 8.8,6.01 22.5,6.01 22.5,13.01 18.5,13.01 18.5,10.01 12.5,10.01 12.5,12.91
ISP_SCK  (via drill 0.25)
  Top 0.254: J3.3 17,21.51
  Top 0.406: 17,21.51 v17,20.26
  Top 0.508: SW2.1 v2.75,21.76
  Route15 0.406: v17,20.26 17,21.51 16.75,21.76 v2.75,21.76
MIOSIO0  (via drill 0.25)
  Top 0.254: U1.30 U1.30F v10.75,7.76 | U2.17 U2._17 21,13.76 v21.5,14.26
  Bottom 0.254: 13,8.01 11,8.01 v10.75,7.76
  Bottom 0.305: v21.5,14.26 21.25,14.01 17,14.01 16.5,13.51 16.5,11.51 16.85,11.16 16.85,8.36 16.5,8.01 13,8.01
MIOSIO1  (via drill 0.25)
  Top 0.254: U2.1 U2._1 17.5,12.26 v17.25,12.01 | U1.31 U1.31F 11.25,8.51 11.75,8.01 v11.75,7.26
  Bottom 0.305: v11.75,7.26 12.45,7.26 12.65,7.46 16.95,7.46 17.4,7.91 17.4,11.86 v17.25,12.01
MIOSIO2  (via drill 0.25)
  Top 0.127: U1.32F U1.32
  Top 0.254: U2.19 U2._19 20,13.76 v19,14.76 | U1.32 12.3,8.91 v12.5,8.71
  Bottom 0.305: v19,14.76 16.25,14.76 15.75,14.26 15.75,11.26 16.3,10.71 16.3,8.86 16,8.56 13.65,8.56 13.5,8.71 v12.5,8.71
MIOSIO3
  Top 0.127: U2.6 U2._6
  Top 0.254: U1.1 U1.1F 13,9.51 13.25,9.26 13.25,8.76 13.75,8.26 16.25,8.26 17.4,9.41 U2.6
MIOSIO4  (via drill 0.25)
  Top 0.254: U2.18 U2._18 v20.5,15.01 | U1.2 U1.2F 13.6,10.01 14,9.61 v14,9.26
  Bottom 0.305: v20.5,15.01 20,15.01 19.5,15.51 18.5,15.51 18.35,15.36 15.85,15.36 15,14.51 15,11.01 15.75,10.26 15.75,9.36 15.5,9.11 14.15,9.11 v14,9.26
MIOSIO5  (via drill 0.25)
  Top 0.254: U1.9 U1.9F 11.75,16.98 11.47,17.26 v10.5,17.26 | U2.4 U2._4 16,10.76 | v17.25,16.76 17.25,13.51 17,13.26 16,13.26
  Top 0.305: 16,13.26 15.75,13.01 15.75,11.01 16,10.76
  Bottom 0.305: v10.5,17.26 11.75,17.26 12.25,16.76 12.75,16.76
  Bottom 0.508: 12.75,16.76 v17.25,16.76
MIOSIO6  (via drill 0.25)
  Top 0.254: U2.5 U2._5 16.5,10.26 16.1,9.86 v15,9.86 | U1.10 U1.10F 11.25,15.51 v11,15.76
  Bottom 0.305: 12.25,14.51 12.25,14.36 | 12.75,10.01 14.85,10.01 v15,9.86
  Bottom 0.508: 12.25,14.36 12.25,10.51 12.75,10.01 | v11,15.76 12.25,14.51
MIOSIO7  (via drill 0.25)
  Top 0.254: v18.5,16.26 17.75,15.51 17.75,13.01 17.5,12.76 16.75,12.76 16.5,12.51 | U1.11 U1.11F 10.75,14.51 v10.5,14.76 | U2.2 U2._2 18.1,11.76 17.6,11.26
  Top 0.305: 16.5,12.51 16.5,11.51 16.75,11.26 17.6,11.26
  Bottom 0.305: v18.5,16.26 18,16.26 17.75,16.01 12,16.01 11.5,16.51 10.5,16.51 10.25,16.26 10.25,15.01 v10.5,14.76
MISO  (via drill 0.25, 0.33)
  Top 0.127: U1.16 U1.16F
  Top 0.254: U1.16 7.65,13.61 v7.25,14.01 | J3.1 20.5,24.05 20.75,23.8
  Top 0.508: 20.75,23.8 20.75,27.01 21,27.26 v23.75,27.26
  Bottom 0.406: 11,28.26 23.75,28.26
  Bottom 0.508: v7.25,14.01 7.25,14.76 5.25,16.76 5.25,22.34 5.75,22.84 7.86,22.84 8.11,23.09 J2.9 | J2.9 8.11,24.87 | 11,28.26 9.25,26.51 9.25,25.59 9,25.34 J2.9 | J2.1 26,19.8 26,20.51 27.25,21.76 27.25,28.01 27,28.26 23.75,28.26 v23.75,27.26
MOSI  (via drill 0.25)
  Top 0.254: U1.15 U1.15F 8.75,14.51 8.5,14.76 v8.38,14.76
  Top 0.508: v22.08,25.51 22.25,25.51 22.5,25.26 22.5,23.28 23,22.78 25.25,22.78 25.75,22.28 25.75,21.69 J3.4
  Bottom 0.254: 10.65,25.26 J2.10
  Bottom 0.305: J2.10 10.65,26.91 11.35,27.61 21.5,27.61 22.08,27.03 22.08,26.36
  Bottom 0.508: 10.65,25.26 10.65,23.26 10.4,23.01 9.55,23.01 9.3,22.76 9.3,15.01 9.05,14.76 v8.38,14.76 | J2.2 23.35,23.41 23.1,23.66 22.33,23.66 22.08,23.91 v22.08,25.51 22.08,26.36
N$1
  Top 0.406: R6.1 9,2.01 8.9,2.11 LED2.4
N$2
  Top 0.254: LED2.1 7.5,3.46 R5.2
N$3
  Top 0.254: U1.7 U1.7F 13,12.51 13.25,12.76 13.25,13.26 13.5,13.51 14.25,13.51 14.8,14.06 C11.1 14.8,14.81 15.15,15.16 X1.3
N$4
  Top 0.127: U1.8 U1.8F
  Top 0.254: U1.8 12.35,14.61 12.5,14.76 13.75,14.76 14,15.01 14,18.01
  Top 0.406: 14,18.01 13.75,18.26 13.25,18.26 12.85,18.66 X1.1 12.85,21.41 13.2,21.76 C12.1
N$10
  Top 0.508: LED1.1 11.18,2.44 R1.2
NOISE_REDUCTION
  Top 0.508: U3.3 3.37,12.95 C9.2
NOT-USED-12
  Top 0.127: U1.12 U1.12F
NOT-USED-18
  Top 0.127: U1.18 U1.18F
NOT-USED-19
  Top 0.127: U1.19 U1.19F
NOT-USED-20
  Top 0.127: U1.20 U1.20F
NOT-USED-22
  Top 0.127: U1.22F U1.22
NOT-USED-27
  Top 0.127: U1.27 U1.27F
NOT-USED-28
  Top 0.127: U1.28 U1.28F
SCK_MASTER
  Top 0.254: 6.5,15.31 6.5,13.26 6.75,13.01 U1.17F U1.17 | SW2.6 8.5,16.31 8.75,16.56 8.75,21.26
  Top 0.406: 8.75,21.26 8.75,23.46 8.5,23.71 SW1.1
  Top 0.508: 6.5,15.31 6.5,16.06 6.75,16.31 SW2.6
SCK_SLAVE  (via drill 0.25)
  Top 0.508: SW2.5 4.5,16.31 4,16.81 4,21.26 4,23.71 | SW1.3 4,23.71 | 4,23.71 4.95,23.71 7,25.76 v11.92,25.76
  Bottom 0.305: 11.92,26.68 12.25,27.01 20.5,27.01 20.81,26.7 J2.14 | J2.6 12.87,20.01
  Bottom 0.508: 12.87,20.01 12.42,20.01 11.92,20.51 v11.92,25.76 11.92,26.68
STATUS_LED  (via drill 0.25, 0.33)
  Top 0.254: U1.26 U1.26F 8.75,8.01 v9,7.76 | LED2.2 7.9,2.66 8.6,3.36 LED2.3 9.85,3.36 v10,3.51
  Bottom 0.508: v9,7.76 8.75,7.51 8.75,3.76 9,3.51 v10,3.51
SWITCHED_ISP_SCK
  Top 0.508: SW2.2 SW1.2
USB_DM
  Top 0.254: U2.9 U2._9 21,7.26 20.75,7.01 19.5,7.01 R2.2
USB_DP
  Top 0.254: U2.8 U2._8 20.5,7.76 R3.2
VBUS
  Top 0.305: J1.1 19.2,4.91 18.8,5.31 18,5.31
  Top 0.406: 18,5.31 15.55,5.31 15.05,4.81 FB1.1
  Top 0.508: C1.1 15.25,4.06 FB1.1

### Text on the board
tPlace: ISP | S.I. | ISP | U.B. | ISP | x | x | SPI | TxRx
bPlace: !SS! | DR | !RST! | SCK | GND | +3.3 | MISO | MOSI | SPI INTERFACE | GND | +3.3V | SCK | !RST! | DR | !SS! | MOSI | MISO | Mates with 0.1-inch socket / Samtec# TSM-108-01-S-DV | SPI INTERFACE / connects to / 20190429-sensor-interface
tNames: RESET | * | *
Document: # View all / dis all; dis -27 -28 -44 / / # View with less noise / dis all; dis -27 -28 -44 -201 -202 -39 -29 -30 -31 -32 -21 -22 -25 -26
Reference: BOARD DIMENSION | 1. *Nominal* board dimension is 29 x 29 mm. / 2. *Precise* dimension is 29 x 29.024 mm. / The extra 0.024 mm is to satisfy the / Design Rule Check for 20-mil clearance / between *copper* and *outline* layers. | SW1 AND SW2 (SPI / Program Flash) | SW1 / --- MCU Select --- / Select MCU to program via ISP. / LEFT: `spi-out` MCU / RIGHT: `usb-bridge` MCU / / SW2 / --- Mode Select --- / RIGHT (normal operation): SPI communication / LEFT: program firmware
201bmp: 20190429 | usb-bridge
202bmp: 20190429-usb-bridge